# Altium schematic sheet SCH.SchDoc
size A4
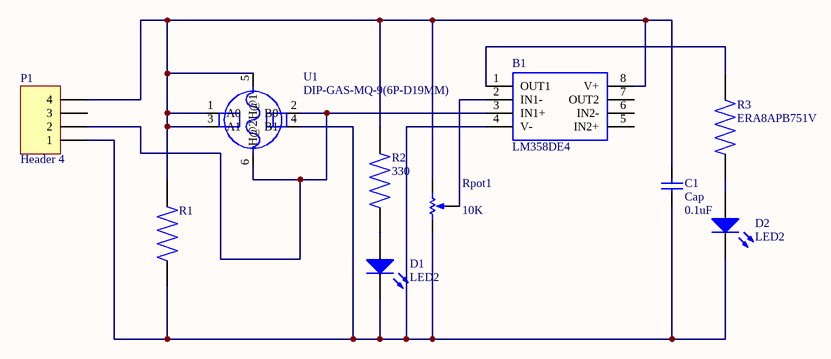
[diagram p0: SCH.SchDoc]

## Parts
B1  LM358DE4  [DIP794W45P254L959H508Q8]
C1  Cap  value 0.1uF  [RAD-0.3]
D1  LED2  [3.2X1.6X1.1]
D2  LED2  [3.2X1.6X1.1]
P1  Header 4  [HDR1X4]
R1  (no value)  [RES_ERA8APB751V]
R2  330  [RES_ERA8APB751V]
R3  ERA8APB751V  [RES_ERA8APB751V]
Rpot1  value 10K  [VR5]
U1  DIP-GAS-MQ-9(6P-D19MM)  [SNR6-D19.0MM]

## Nets
NetB1_1: B1.1(OUT1) R3.2
NetB1_2: B1.2(IN1-) Rpot1.3(TAP)
NetB1_3: B1.3(IN1+) P1.2 U1.2(B0) U1.6(H@2)
NetB1_4: B1.4(V-) C1.1 D1.2(K) D2.2(K) P1.1 R1.1 Rpot1.1(TOP) U1.4(B1)
NetB1_8: B1.8(V+) C1.2 P1.4 R1.2 R2.2 Rpot1.2(BOT) U1.1(A0) U1.3(A1) U1.5(H@1)
NetD1_1: D1.1(A) R2.1
NetD2_1: D2.1(A) R3.1

Not connected (* = marked no-connect by the designer): B1 5(IN2+) 6(IN2-) 7(OUT2); P1 3

## Library data of the parts
B1 = LM358DE4: Manufacturer_Name: Texas Instruments; Geometry.Height: 1.75mm; Manufacturer_Part_Number: LM358DE4; Mouser Part Number: 595-LM358DE4; Mouser Price/Stock: https://www.mouser.com/Search/ProductDetail.aspx?qs=VBduBm9rCJQTkaX6SbhomQ%3d%3d; Arrow Part Number: LM358DE4; Arrow Price/Stock: https://www.arrow.com/en/products/lm358de4/texas-instruments; Mouser Testing Part Number: *; Mouser Testing Price/Stock: *; Datasheet Link: https://www.ti.com/lit/ds/symlink/lm358.pdf?HQS=dis-dk-null-digikeymode-dsf-pf-null-wwe&ts=1639319952281&ref_url=https%253A%252F%252Fwww.ti.com%252Fgeneral%252Fdocs%252Fsuppproductinfo.tsp%253FdistId%253D10%2526gotoUrl%253Dhttps%253A%252F%252Fwww.ti.com%2
C1 = Cap: Capacitor; Published: 8-Jun-2000; LatestRevisionDate: 17-Jul-2002; LatestRevisionNote: Re-released for DXP Platform.; PackageReference: RAD-0.3; Publisher: Altium Limited; PackageDescription: Radial Cap, Thru-Hole; 2 Leads; 0.3 in Pin Spacing
D1 D2 = LED2: Typical RED, GREEN, YELLOW, AMBER GaAs LED; Published: 8-Jun-2000; LatestRevisionDate: 17-Jul-2002; LatestRevisionNote: Re-released for DXP Platform.; PackageVersion: Feb-2002; PackageReference: 3.2X1.6X1.1; Publisher: Altium Limited; PackageDescription: SM LED; 2 Flat Leads
P1 = Header 4: Header, 4-Pin; LatestRevisionDate: 17-Jul-2002; LatestRevisionNote: Re-released for DXP Platform.; Publisher: Altium Limited
R1 R2 = ERA8APB751V: Availability: Unavailable; MP: ERA8APB751V; Price: None; Value: *; Package: None
Rpot1 = RPot: Potentiometer; Sim Note: Enter the Resistance value and the set point into parameter fields.; Set Position: 0.5; Published: 8-Jun-2000; LatestRevisionDate: 17-Jul-2002; LatestRevisionNote: Re-released for DXP Platform.; PackageReference: VR5; Publisher: Altium Limited; PackageDescription: Variable Resistor, Thru-Hole; 3 Leads
U1 = DIP-GAS-MQ-9(6P-D19MM): 47ÂµF Â±20% 6.3V Ceramic Capacitor X5R 0805 _2012 Metric_; MF: Samsung Electro-Mechanics; MP: MQ-9; SnapEDA_Link: https://www.snapeda.com/parts/MQ-9/Samsung%20Electro-Mechanics/view-part/106079/?ref=snap; Value: *; Package: 0805 Mac8; Price: None; Availability: Unavailable
R3 = ERA8APB751V: Availability: Unavailable; MP: ERA8APB751V; Price: None; Value: *; Package: None